# EAGLE design boost-regulator (EAGLE 7.2.0)
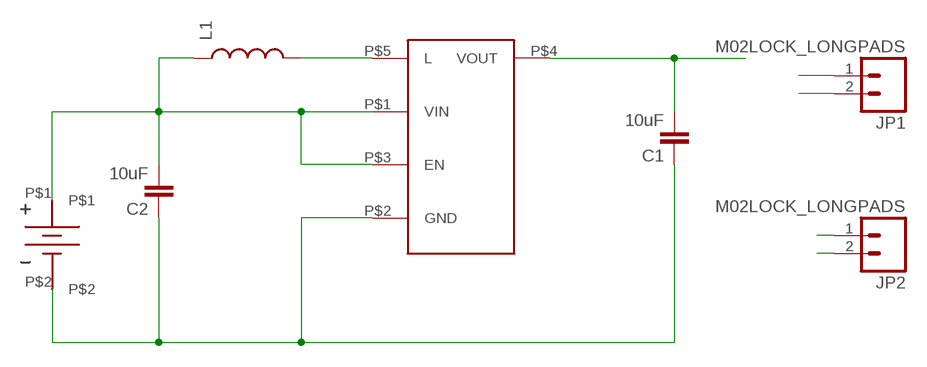
[diagram p0: schematic, sheet 1]

## Parts
C1  10uF  10UF-6.3V-20%(0603)  [0603-CAP]
C2  10uF  10UF-6.3V-20%(0603)  [0603-CAP]
JP1  M02LOCK_LONGPADS  [1X02_LOCK_LONGPADS]
JP2  M02LOCK_LONGPADS  [1X02_LOCK_LONGPADS]
L1  INDUCTOR0603  [0603]
U$1  KEYSTONEAAHOLDER_2CELL  [KEYSTONEAAHOLDER_2CELL]
U$2  TPS61097-33  [SOT23-5]

## Nets
GND: C1.1 C2.1 JP1.2 JP2.2 U$1.P$2 U$2.P$2(GND)
N$4: L1.2 U$2.P$5(L)
VCC: C1.2 JP1.1 JP2.1 U$2.P$4(VOUT)
VIN: C2.2 L1.1 U$1.P$1 U$2.P$1(VIN) U$2.P$3(EN)

## Library data of the parts
C1 C2 = SparkFun-Capacitors:10UF-6.3V-20%(0603): CAP-11015; PROD_ID: CAP-11015
JP1 JP2 = SparkFun-Connectors:M02: Standard 2-pin 0.1" header. Use with - straight break away headers ( PRT-00116) - right angle break away headers (PRT-00553) - swiss pins (PRT-00743) - machine pins (PRT-00117) - female headers (PRT-00115) Molex polarized connector foot print use with: PRT-08233 with associated crimp pins and housings. 2.54_SCREWTERM for use with PRT-10571. 3.5mm Screw Terminal footprints for PRT-08084 5mm Screw Terminal footprints for use with PRT-08433
L1 = SparkFun-Passives:INDUCTOR: Inductors Basic Inductor/Choke - 0603 and 1206. Footprints are not proven and vary greatly between part numbers. SRN6045- 33uH, 20% 1.4A SDR0403-560KL - 56uH, 10%, 500mA RMS/740mA peak
U$1 = myRandomThings:KEYSTONEAAHOLDER_2CELL
U$2 = myRandomThings:TPS61097-33

## Board
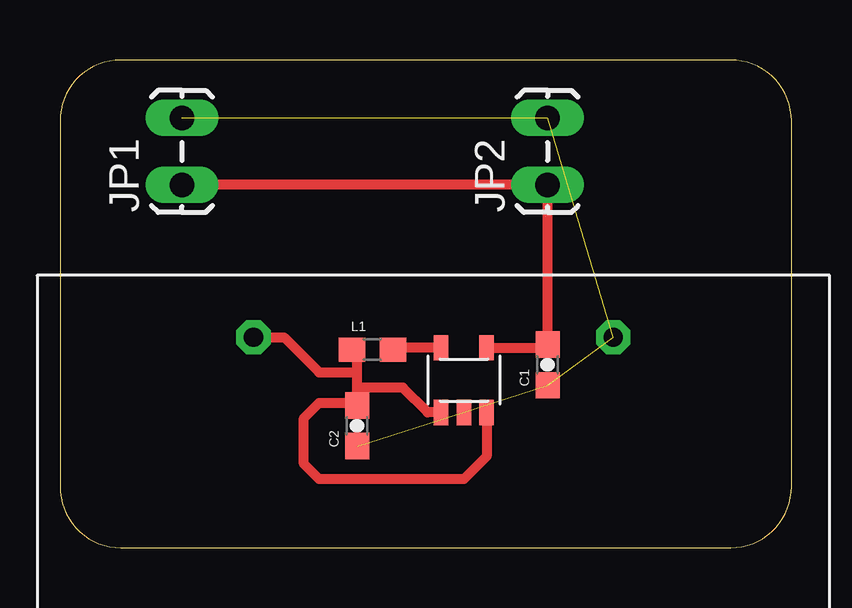
[diagram p1: board, top side]

Size 30.48 x 20.32 mm. Coordinates in mm from the lower left corner, seen from the top.
Outline: 0,17.78 0,2.54 arc90 2.54,0 27.94,0 arc90 30.48,2.54 30.48,17.78 arc90 27.94,20.32 2.54,20.32 arc90 0,17.78
Copper layers (1*16): Top 0.035mm / dielectric 1.5mm / Bottom 0.035mm
Design rules "default": minimum track width 10mil, minimum drill 24mil, track to track 8mil, track to pad 8mil, pad to pad 8mil, via to via 8mil, smd to smd 8mil, copper to edge 40mil, drill to drill 8mil, minimum pad ring 10mil, minimum via ring 8mil, stop-mask expansion 4mil, vias tented up to drill 0mil, thermal gap 10mil

### Footprints (pad centres in the part's own frame; a part is rotated, then mirrored left to right if it is on the bottom)
0603-CAP = smd 1.1 x 1: 1 -0.85,0; 2 0.85,0
1X02_LOCK_LONGPADS = drill 1.016 long: 1 -0.127,0; 2 2.667,0
0603 = smd 1.1 x 1: 1 -0.85,0; 2 0.85,0
KEYSTONEAAHOLDER_2CELL = drill 0.8 pad 1.422 octagon: P$1 -7.493,27.178; P$2 7.493,27.178
SOT23-5 = smd 0.6 x 1.05: P$1 -0.95,-1.35; P$2 0,-1.35; P$3 0.95,-1.35; P$4 0.95,1.35; P$5 -0.95,1.35

### Placement (x,y rotation side)
C1  20.32,7.62 90 top
C2  12.38,5.08 90 top
JP1  5.08,15.24 90 top
JP2  20.32,15.24 90 top
L1  13.02,8.26 0 top
U$1  15.56,-18.41 0 top
U$2  16.83,6.99 0 top

### Tracks (layer width: path | path; a pad name or v marks a point on that pad's centre or on a via)
GND  (5 unrouted)
N$4
  Top 0.406: U$2.P$5 13.95,8.34 L1.2
VCC
  Top 0.406: U$2.P$4 20.18,8.34 C1.2 JP2.1 JP1.1
VIN
  Top 0.406: 12.38,6.67 C2.2 12.28,6.03 10.79,6.03 10.16,5.4 10.16,3.49 10.79,2.86 16.83,2.86 17.78,3.81 U$2.P$3 | 12.38,6.67 12.38,7.3 | 12.38,7.3 12.38,8.04 L1.1 | U$2.P$1 15.32,5.63 14.29,6.67 12.38,6.67 | U$1.P$1 9.34,8.76 10.79,7.3 12.38,7.3